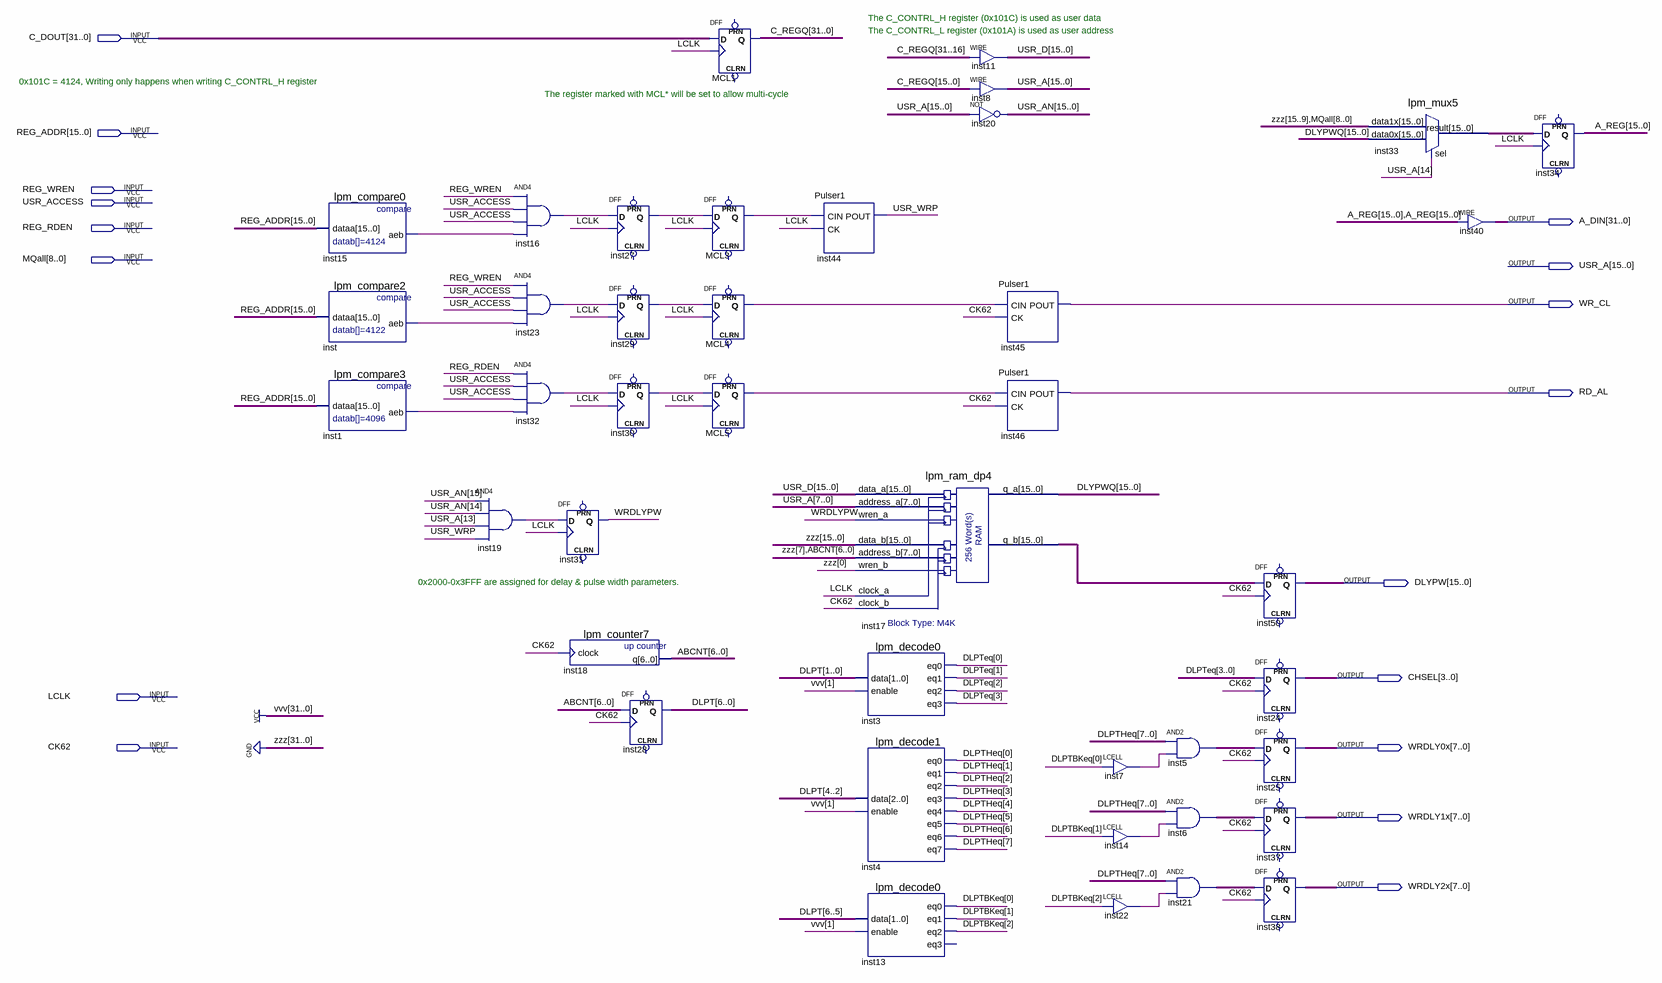
[diagram p0: schematic sheet]
// Quartus schematic DLYPW_IO3.bdf as structural Verilog: 41 symbols, 17 pins
module DLYPW_IO3 (
  input  [31:0] C_DOUT,
  input  [15:0] REG_ADDR,
  input  REG_WREN,
  input  USR_ACCESS,
  input  REG_RDEN,
  input  [8:0] MQall,
  input  LCLK,
  input  CK62,
  output [31:0] A_DIN,
  output [15:0] USR_A,
  output WR_CL,
  output RD_AL,
  output [15:0] DLYPW,
  output [3:0] CHSEL,
  output [7:0] WRDLY0x,
  output [7:0] WRDLY1x,
  output [7:0] WRDLY2x
);

  wire inst1_aeb, inst7_out, inst14_out, inst15_aeb, inst16_out, inst19_out, inst22_out, inst23_out,
       inst27_q, inst29_q, inst30_q, inst32_out, inst_aeb, MCL3_q, MCL4_q, MCL5_q, USR_WRP, WRDLYPW;
  wire [2:0] DLPTBKeq;
  wire [3:0] DLPTeq;
  wire [6:0] ABCNT, DLPT;
  wire [7:0] DLPTHeq, inst5_out, inst6_out, inst21_out;
  wire [15:0] A_REG, DLYPWQ, inst17_q_b, inst33_result, USR_AN, USR_D;
  wire [31:0] C_REGQ;

  lpm_compare0 inst15 (.dataa(REG_ADDR), .aeb(inst15_aeb));
  lpm_compare2 inst (.dataa(REG_ADDR), .aeb(inst_aeb));
  lpm_compare3 inst1 (.dataa(REG_ADDR), .aeb(inst1_aeb));
  and inst19 (inst19_out, USR_AN[15], USR_AN[14], USR_A[13], USR_WRP);
  and inst16 (inst16_out, REG_WREN, USR_ACCESS, USR_ACCESS, inst15_aeb);
  and inst23 (inst23_out, REG_WREN, USR_ACCESS, USR_ACCESS, inst_aeb);
  and inst32 (inst32_out, REG_RDEN, USR_ACCESS, USR_ACCESS, inst1_aeb);
  DFF inst31 (.CLK(LCLK), .D(inst19_out), .Q(WRDLYPW));  // open: CLRN, PRN
  lpm_counter7 inst18 (.clock(CK62), .q(ABCNT));
  DFF inst27 (.CLK(LCLK), .D(inst16_out), .Q(inst27_q));  // open: CLRN, PRN
  DFF inst29 (.CLK(LCLK), .D(inst23_out), .Q(inst29_q));  // open: CLRN, PRN
  DFF inst30 (.CLK(LCLK), .D(inst32_out), .Q(inst30_q));  // open: CLRN, PRN
  DFF inst28[6:0] (.CLK(CK62), .D(ABCNT), .Q(DLPT));  // open: CLRN, PRN
  DFF MCL1[31:0] (.CLK(LCLK), .D(C_DOUT), .Q(C_REGQ));  // open: CLRN, PRN
  DFF MCL3 (.CLK(LCLK), .D(inst27_q), .Q(MCL3_q));  // open: CLRN, PRN
  DFF MCL4 (.CLK(LCLK), .D(inst29_q), .Q(MCL4_q));  // open: CLRN, PRN
  DFF MCL5 (.CLK(LCLK), .D(inst30_q), .Q(MCL5_q));  // open: CLRN, PRN
  Pulser1 inst44 (.CIN(MCL3_q), .CK(LCLK), .POUT(USR_WRP));
  lpm_ram_dp4 inst17 (
    .data_a(USR_D), .address_a(USR_A[7:0]), .wren_a(WRDLYPW), .data_b({16{1'b0}}), .address_b({1'b0, ABCNT}),
    .wren_b(1'b0), .clock_a(LCLK), .clock_b(CK62), .q_a(DLYPWQ), .q_b(inst17_q_b));
  lpm_decode0 inst3 (
    .data(DLPT[1:0]), .enable(1'b1), .eq0(DLPTeq[0]), .eq1(DLPTeq[1]), .eq2(DLPTeq[2]), .eq3(DLPTeq[3]));
  lpm_decode1 inst4 (
    .data(DLPT[4:2]), .enable(1'b1), .eq0(DLPTHeq[0]), .eq1(DLPTHeq[1]), .eq2(DLPTHeq[2]), .eq3(DLPTHeq[3]),
    .eq4(DLPTHeq[4]), .eq5(DLPTHeq[5]), .eq6(DLPTHeq[6]), .eq7(DLPTHeq[7]));
  lpm_decode0 inst13 (
    .data(DLPT[6:5]), .enable(1'b1), .eq0(DLPTBKeq[0]), .eq1(DLPTBKeq[1]), .eq2(DLPTBKeq[2]));  // open: eq3
  assign USR_D = C_REGQ[31:16];  // WIRE inst11
  assign USR_A = C_REGQ[15:0];  // WIRE inst8
  assign USR_AN = ~USR_A;  // NOT inst20, 16 bits wide
  Pulser1 inst45 (.CIN(MCL4_q), .CK(CK62), .POUT(WR_CL));
  Pulser1 inst46 (.CIN(MCL5_q), .CK(CK62), .POUT(RD_AL));
  LCELL inst7 (.IN(DLPTBKeq[0]), .OUT(inst7_out));
  LCELL inst14 (.IN(DLPTBKeq[1]), .OUT(inst14_out));
  LCELL inst22 (.IN(DLPTBKeq[2]), .OUT(inst22_out));
  assign inst5_out = DLPTHeq & {8{inst7_out}};  // AND2 inst5, 8 bits wide
  assign inst6_out = DLPTHeq & {8{inst14_out}};  // AND2 inst6, 8 bits wide
  assign inst21_out = DLPTHeq & {8{inst22_out}};  // AND2 inst21, 8 bits wide
  DFF inst50[15:0] (.CLK(CK62), .D(inst17_q_b), .Q(DLYPW));  // open: CLRN, PRN
  DFF inst24[3:0] (.CLK(CK62), .D(DLPTeq), .Q(CHSEL));  // open: CLRN, PRN
  DFF inst25[7:0] (.CLK(CK62), .D(inst5_out), .Q(WRDLY0x));  // open: CLRN, PRN
  DFF inst37[7:0] (.CLK(CK62), .D(inst6_out), .Q(WRDLY1x));  // open: CLRN, PRN
  DFF inst38[7:0] (.CLK(CK62), .D(inst21_out), .Q(WRDLY2x));  // open: CLRN, PRN
  lpm_mux5 inst33 (.data1x({{7{1'b0}}, MQall}), .data0x(DLYPWQ), .sel(USR_A[14]), .result(inst33_result));
  assign A_DIN = {A_REG, A_REG};  // WIRE inst40
  DFF inst34[15:0] (.CLK(LCLK), .D(inst33_result), .Q(A_REG));  // open: CLRN, PRN

  // Notes on the sheet:
  //   The C_CONTRL_H register (0x101C) is used as user data
  //   The C_CONTRL_L register (0x101A) is used as user address
  //   0x101C = 4124, Writing only happens when writing C_CONTRL_H register
  //   The register marked with MCL* will be set to allow multi-cycle
  //   0x2000-0x3FFF are assigned for delay & pulse width parameters.
endmodule
